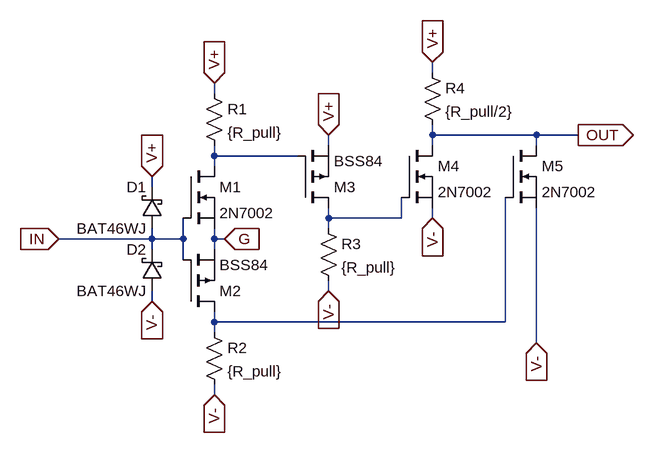
[diagram p0: schematic tri_sel1.asc]
tri_sel1.asc, the LTspice schematic file:
Version 4
SHEET 1 1212 1108
WIRE 368 -48 368 -64
WIRE 32 -16 32 -32
WIRE 368 48 368 32
WIRE 528 48 368 48
WIRE 592 48 528 48
WIRE 208 64 208 48
WIRE 368 64 368 48
WIRE 528 64 528 48
WIRE 32 80 32 64
WIRE 160 80 32 80
WIRE 32 96 32 80
WIRE -64 128 -64 112
WIRE 208 176 208 160
WIRE 320 176 320 144
WIRE 320 176 208 176
WIRE 368 176 368 160
WIRE 208 192 208 176
WIRE -64 208 -64 192
WIRE -64 208 -208 208
WIRE -16 208 -16 176
WIRE -16 208 -64 208
WIRE 32 208 32 192
WIRE 48 208 32 208
WIRE -64 224 -64 208
WIRE 32 224 32 208
WIRE -16 240 -16 208
WIRE 208 288 208 272
WIRE -64 304 -64 288
WIRE 32 336 32 320
WIRE 480 336 480 144
WIRE 480 336 32 336
WIRE 32 352 32 336
WIRE 528 368 528 160
WIRE 32 448 32 432
FLAG -64 112 V+
IOPIN -64 112 In
FLAG -64 304 V-
IOPIN -64 304 In
FLAG 48 208 G
IOPIN 48 208 In
FLAG -208 208 IN
IOPIN -208 208 In
FLAG 592 48 OUT
IOPIN 592 48 Out
FLAG 32 -32 V+
IOPIN 32 -32 In
FLAG 208 48 V+
IOPIN 208 48 In
FLAG 368 -64 V+
IOPIN 368 -64 In
FLAG 32 448 V-
IOPIN 32 448 In
FLAG 208 288 V-
IOPIN 208 288 In
FLAG 368 176 V-
IOPIN 368 176 In
FLAG 528 368 V-
IOPIN 528 368 In
SYMBOL schottky -48 192 R180
WINDOW 0 24 64 Left 2
WINDOW 3 24 0 Left 2
SYMATTR InstName D1
SYMATTR Value BAT46WJ
SYMATTR Description Diode
SYMATTR Type diode
SYMBOL schottky -48 288 R180
WINDOW 0 24 64 Left 2
WINDOW 3 24 0 Left 2
SYMATTR InstName D2
SYMATTR Value BAT46WJ
SYMATTR Description Diode
SYMATTR Type diode
SYMBOL nmos -16 96 R0
SYMATTR InstName M1
SYMATTR Value 2N7002
SYMBOL pmos -16 320 M180
SYMATTR InstName M2
SYMATTR Value BSS84
SYMBOL res 16 -32 R0
SYMATTR InstName R1
SYMATTR Value {R_pull}
SYMBOL res 16 336 R0
SYMATTR InstName R2
SYMATTR Value {R_pull}
SYMBOL pmos 160 160 M180
SYMATTR InstName M3
SYMATTR Value BSS84
SYMBOL res 192 176 R0
SYMATTR InstName R3
SYMATTR Value {R_pull}
SYMBOL nmos 320 64 R0
SYMATTR InstName M4
SYMATTR Value 2N7002
SYMBOL nmos 480 64 R0
SYMATTR InstName M5
SYMATTR Value 2N7002
SYMBOL res 352 -64 R0
SYMATTR InstName R4
SYMATTR Value {R_pull/2}

The netlist it stands for:
* tri_sel1.asc
D1 IN V+ BAT46WJ
D2 V- IN BAT46WJ
M1 N001 IN G G 2N7002
M2 N003 IN G G BSS84
R1 V+ N001 {R_pull}
R2 N003 V- {R_pull}
M3 N002 N001 V+ V+ BSS84
R3 N002 V- {R_pull}
M4 OUT N002 V- V- 2N7002
M5 OUT N003 V- V- 2N7002
R4 V+ OUT {R_pull/2}
.model D D
.lib standard.dio
.model NMOS NMOS
.model PMOS PMOS
.lib standard.mos
.backanno
.end